# EasyEDA Pro project ESD2 .eprj

# Schematic Schematic1
Board Name: Board1; Create Date: 2026-05-03; Page Name: P1; Project Name: New Project_2026-05-03_08-26-41; Schematic Name: Schematic1; Update Date: 2026-05-03; Company: EasyEDA.com; Page Size: A4; Version: V1.0
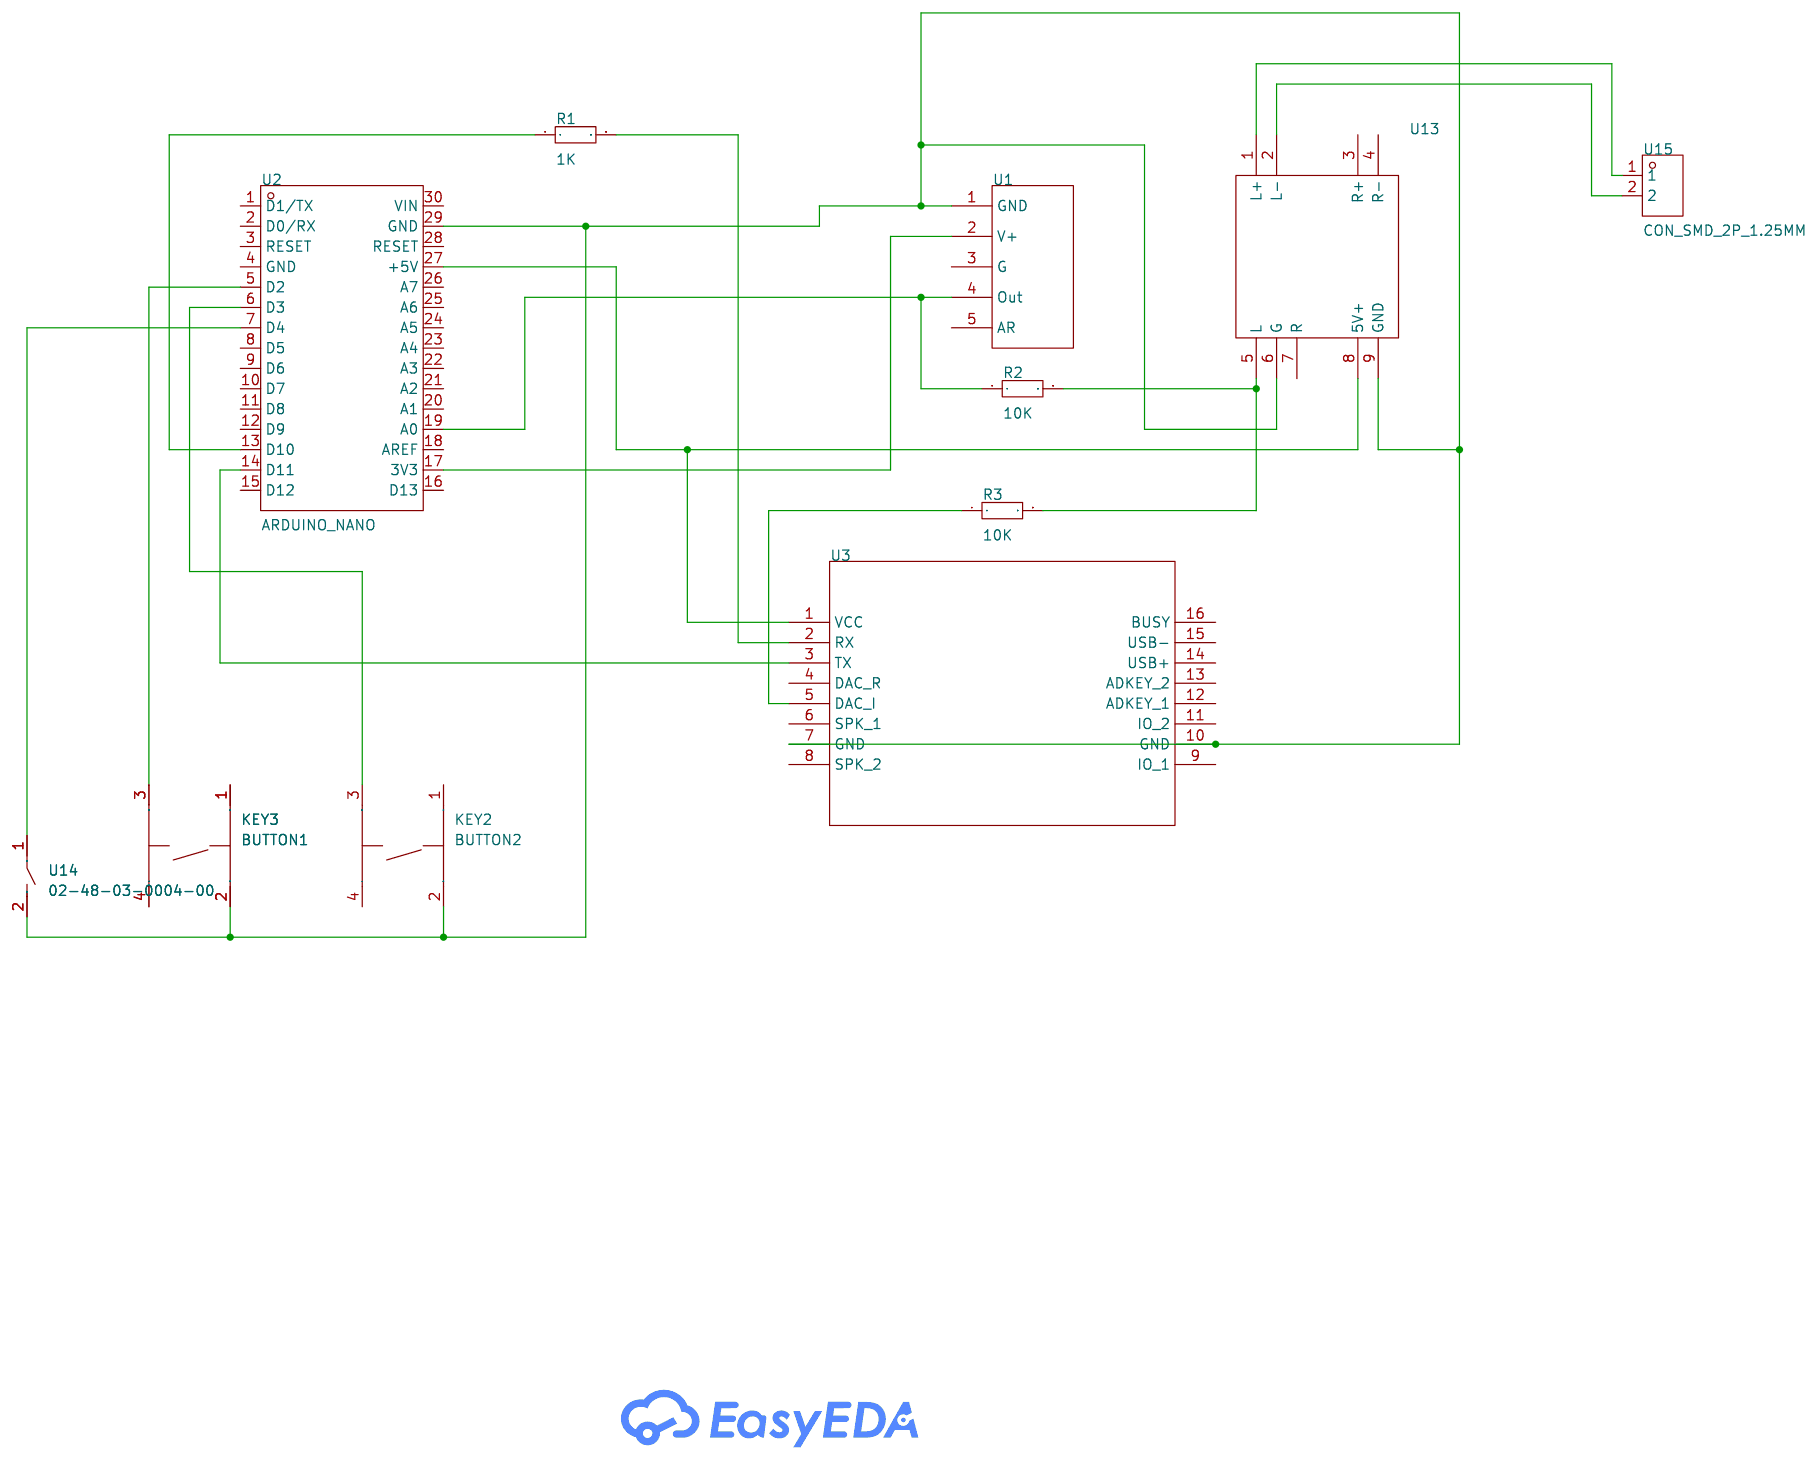
[diagram p0: schematic sheet]

## Parts
KEY2  BUTTON2  [KEY-TH_4P-L6.0-W6.0-P4.50-LS6.5_TC-1102-C-K-B]
KEY3  BUTTON1  [KEY-TH_4P-L6.0-W6.0-P4.50-LS6.5_TC-1102-C-K-B]
R1  1K  [RES-TH_BD2.3-W6.1-P10.10-D0.7]
R2  10K  [RES-TH_BD2.3-W6.1-P10.10-D0.7]
R3  10K  [RES-TH_BD2.3-W6.1-P10.10-D0.7]
U1  -  [Max9814]
U2  ARDUINO_NANO  [COMM-TH_ARDUINO_NANO]
U3  -  [DFPlayer Mini]
U13  -  [Pam8403]
U14  02-48-03-0004-00  [KEY-TH_2P-L6.1-W3.5-P6.50]
U15  CON_SMD_2P_1.25MM  [CONN-TH_C9900006819]

## Library data of the parts
KEY2 KEY3 = BUTTON1: Supplier Part: C9900018962; Supplier Footprint: SMD-4P; JLCPCB Part Class: Extended Part; Supplier: LCSC
R1-R3 = Res_0603: Supplier Footprint: 0603
U1 = Max9814
U2 = ARDUINO_NANO: Supplier Part: C9900017879; Supplier Footprint: 插件; JLCPCB Part Class: Extended Part; Supplier: LCSC
U3 = DFPlayer Mini
U13 = PamFinal
U14 = 02-48-03-0004-00: Supplier Part: C9900014407; Supplier Footprint: SWITCH2-01; JLCPCB Part Class: Extended Part; Supplier: LCSC
U15 = CON_SMD_2P_1.25MM: Supplier Part: C9900006819; Supplier Footprint: SPEAKER; JLCPCB Part Class: Extended Part; Supplier: LCSC

## Nets
Net-(KEY2-2): KEY2.2 KEY3.2 U1.1(GND) U2.29(GND) U3.7(GND) U3.10(GND) U13.6(G) U13.9(GND) U14.2
Net-(KEY2-3): KEY2.3 U2.6(D3)
Net-(KEY3-3): KEY3.3 U2.5(D2)
Net-(R1-1): R1.1 U2.13(D10)
Net-(R1-2): R1.2 U3.2(RX)
Net-(R2-1): R2.1 U1.4(Out) U2.19(A0)
Net-(R2-2): R2.2 R3.2 U13.5(L)
Net-(R3-1): R3.1 U3.5(DAC_I)
Net-(U1-2): U1.2(V+) U2.17(3V3)
Net-(U2-7): U2.7(D4) U14.1
Net-(U2-14): U2.14(D11) U3.3(TX)
Net-(U2-27): U2.27(+5V) U3.1(VCC) U13.8(5V+)
Net-(U13-1): U13.1(L+) U15.1
Net-(U13-2): U13.2(L-) U15.2

Not connected (* = marked no-connect by the designer): KEY2 1 4; KEY3 1 4; U1 3(G) 5(AR); U2 1(D1/TX) 2(D0/RX) 3(RESET) 4(GND) 8(D5) 9(D6) 10(D7) 11(D8) 12(D9) 15(D12) 16(D13) 18(AREF) 20(A1) 21(A2) 22(A3) 23(A4) 24(A5) 25(A6) 26(A7) 28(RESET) 30(VIN); U3 4(DAC_R) 6(SPK_1) 8(SPK_2) 9(IO_1) 11(IO_2) 12(ADKEY_1) 13(ADKEY_2) 14(USB+) 15(USB-) 16(BUSY); U13 3(R+) 4(R-) 7(R)

# Schematic Schematic2
Board Name: PCB2; Create Date: 2026-05-03; Page Name: P1; Project Name: New Project_2026-05-03_08-26-41; Schematic Name: Schematic2; Update Date: 2026-05-03; Company: EasyEDA.com; Page Size: A4; Version: V1.0
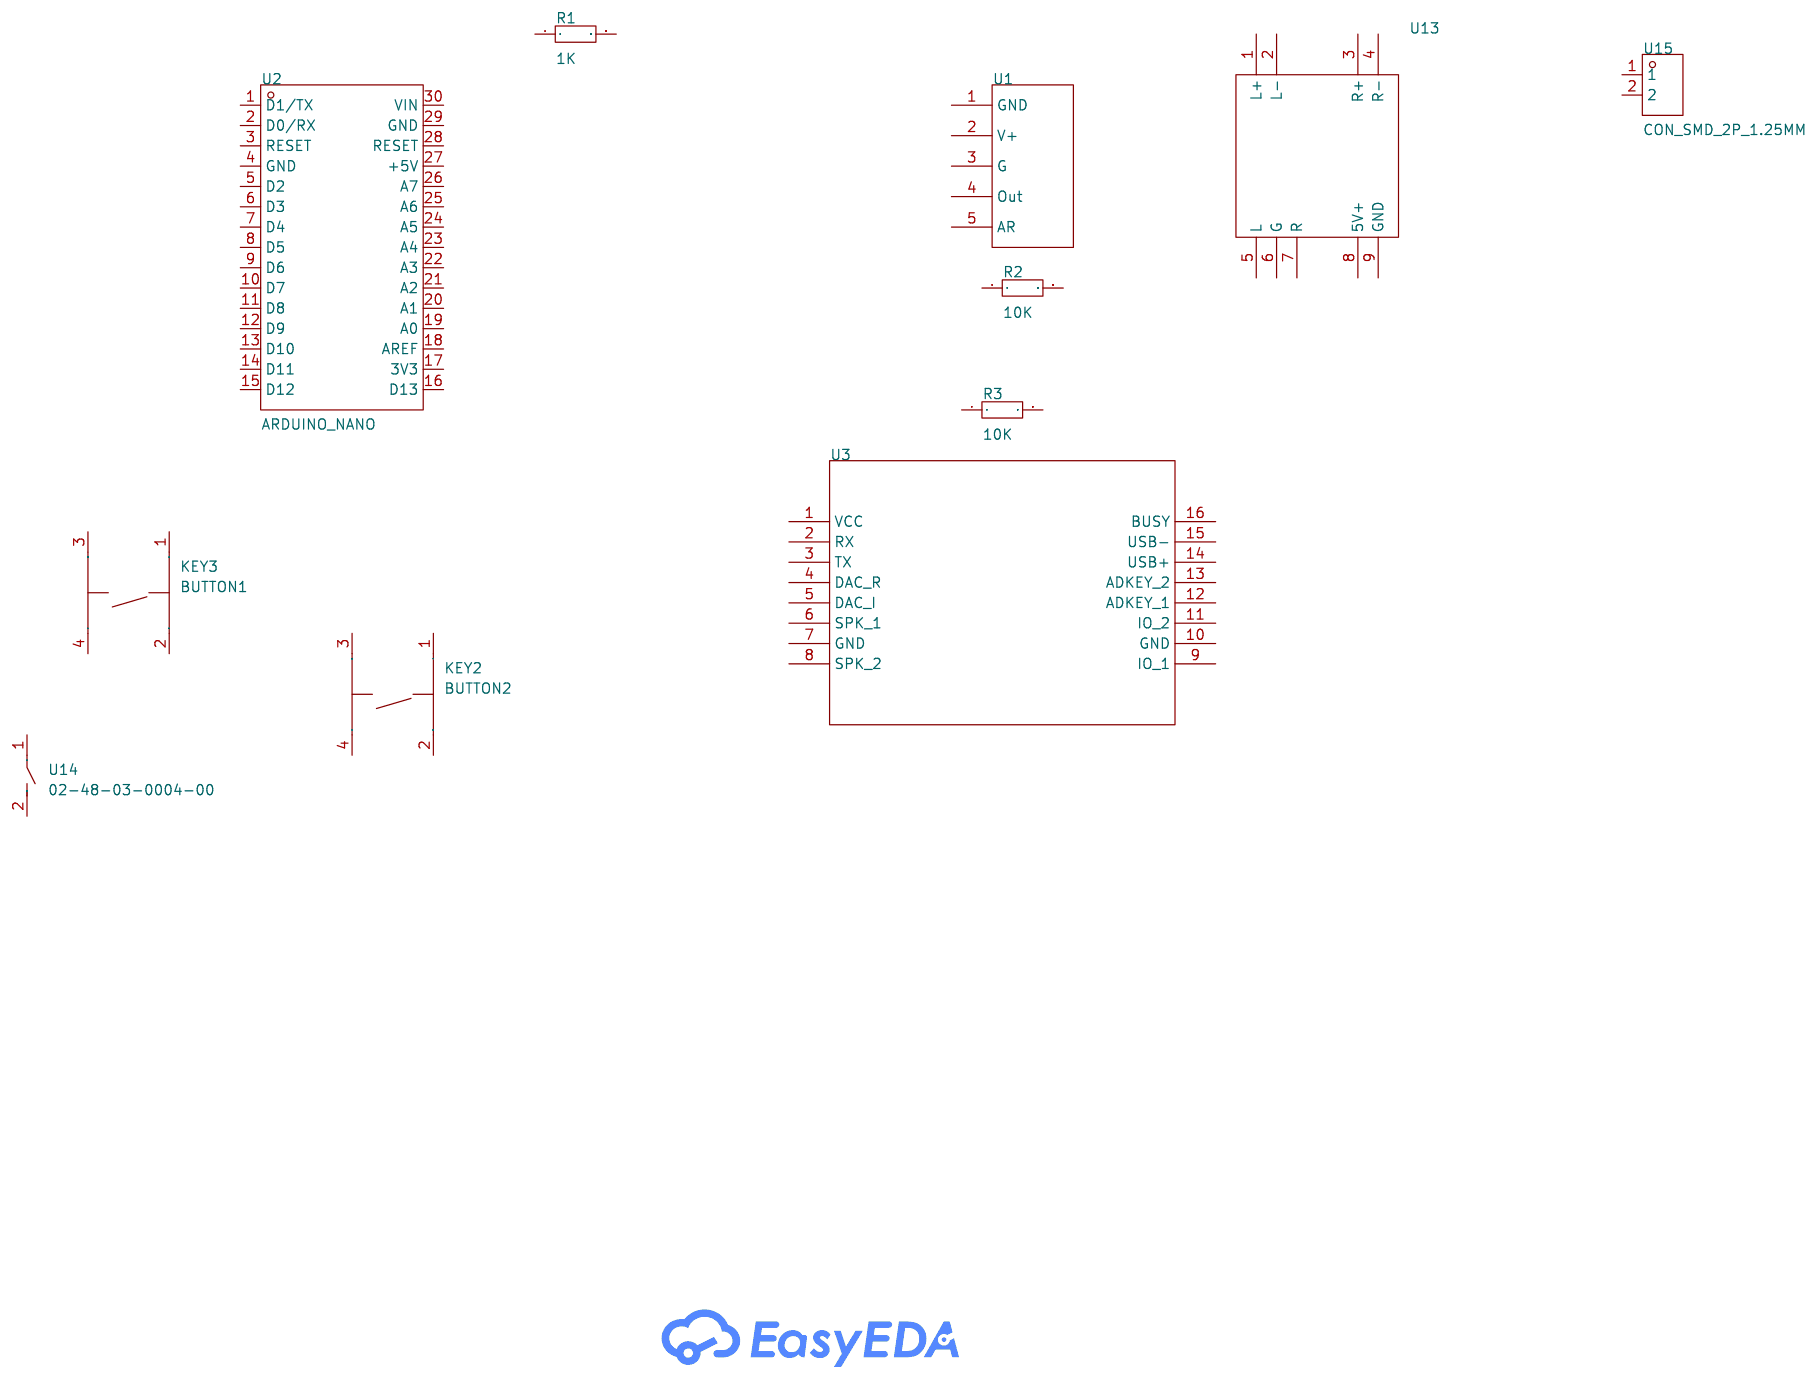
[diagram p1: schematic sheet]

## Parts
KEY2  BUTTON2  [KEY-TH_4P-L6.0-W6.0-P4.50-LS6.5_TC-1102-C-K-B]
KEY3  BUTTON1  [KEY-TH_4P-L6.0-W6.0-P4.50-LS6.5_TC-1102-C-K-B]
R1  1K  [RES-TH_BD2.3-W6.1-P10.10-D0.7]
R2  10K  [RES-TH_BD2.3-W6.1-P10.10-D0.7]
R3  10K  [RES-TH_BD2.3-W6.1-P10.10-D0.7]
U1  -  [Max9814]
U2  ARDUINO_NANO  [COMM-TH_ARDUINO_NANO]
U3  -  [DFPlayer Mini]
U13  -  [Pam8403]
U14  02-48-03-0004-00  [KEY-TH_2P-L6.1-W3.5-P6.50]
U15  CON_SMD_2P_1.25MM  [CONN-TH_C9900006819]

## Library data of the parts
KEY2 KEY3 = BUTTON1: Supplier Part: C9900018962; Supplier Footprint: SMD-4P; JLCPCB Part Class: Extended Part; Supplier: LCSC
R1-R3 = Res_0603: Supplier Footprint: 0603
U1 = Max9814
U2 = ARDUINO_NANO: Supplier Part: C9900017879; Supplier Footprint: 插件; JLCPCB Part Class: Extended Part; Supplier: LCSC
U3 = DFPlayer Mini
U13 = PamFinal
U14 = 02-48-03-0004-00: Supplier Part: C9900014407; Supplier Footprint: SWITCH2-01; JLCPCB Part Class: Extended Part; Supplier: LCSC
U15 = CON_SMD_2P_1.25MM: Supplier Part: C9900006819; Supplier Footprint: SPEAKER; JLCPCB Part Class: Extended Part; Supplier: LCSC

## Nets

Not connected (* = marked no-connect by the designer): KEY2 1 2 3 4; KEY3 1 2 3 4; R1 1 2; R2 1 2; R3 1 2; U1 1(GND) 2(V+) 3(G) 4(Out) 5(AR); U2 1(D1/TX) 2(D0/RX) 3(RESET) 4(GND) 5(D2) 6(D3) 7(D4) 8(D5) 9(D6) 10(D7) 11(D8) 12(D9) 13(D10) 14(D11) 15(D12) 16(D13) 17(3V3) 18(AREF) 19(A0) 20(A1) 21(A2) 22(A3) 23(A4) 24(A5) 25(A6) 26(A7) 27(+5V) 28(RESET) 29(GND) 30(VIN); U3 1(VCC) 2(RX) 3(TX) 4(DAC_R) 5(DAC_I) 6(SPK_1) 7(GND) 8(SPK_2) 9(IO_1) 10(GND) 11(IO_2) 12(ADKEY_1) 13(ADKEY_2) 14(USB+) 15(USB-) 16(BUSY); U13 1(L+) 2(L-) 3(R+) 4(R-) 5(L) 6(G) 7(R) 8(5V+) 9(GND); U14 1 2; U15 1 2

# Board PCB2
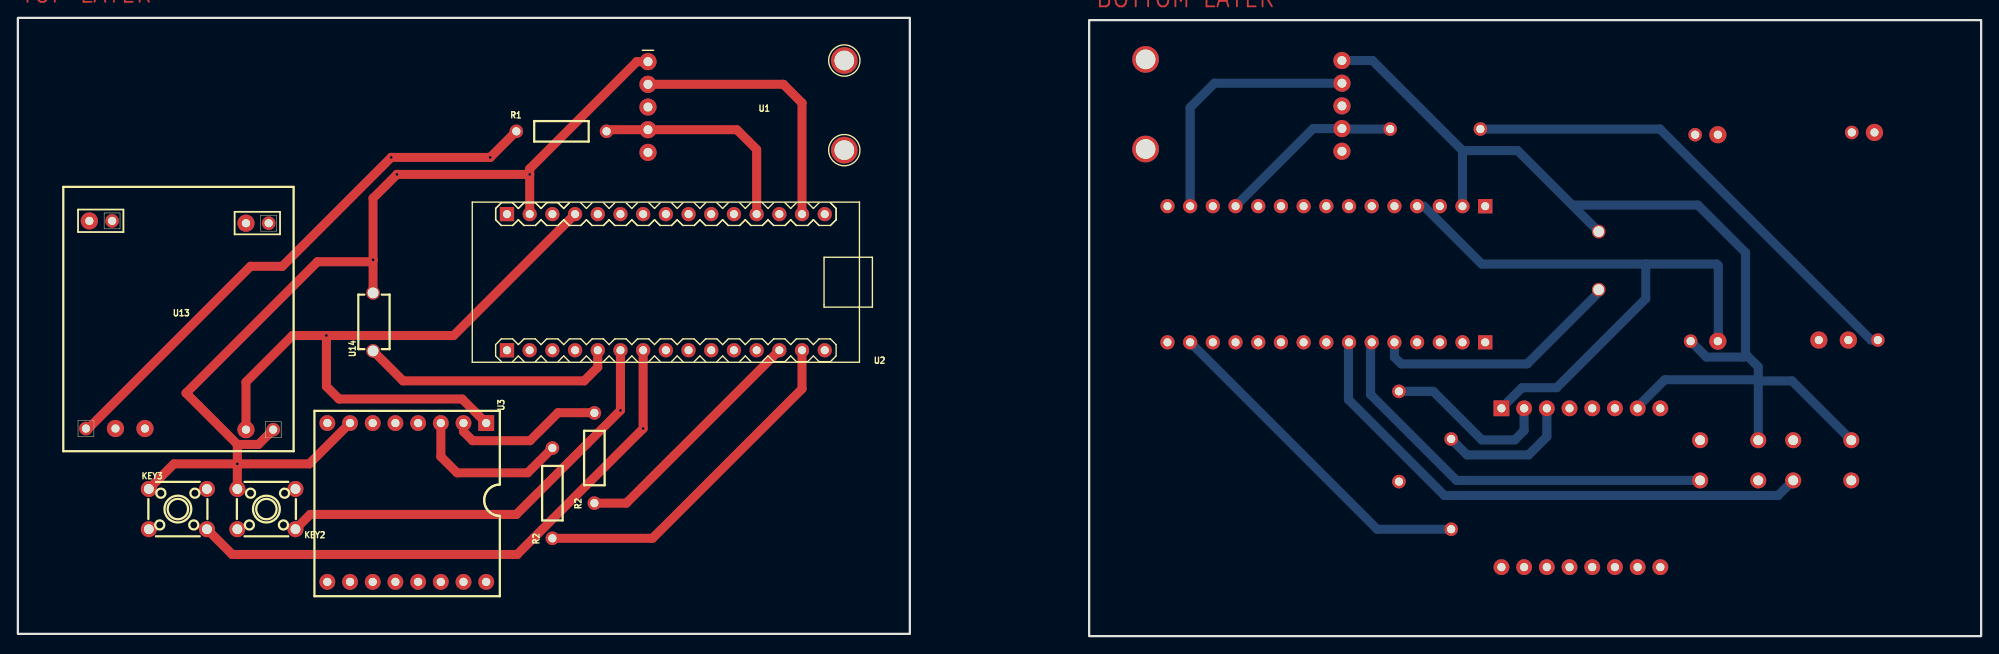
[diagram p2: board, top side]
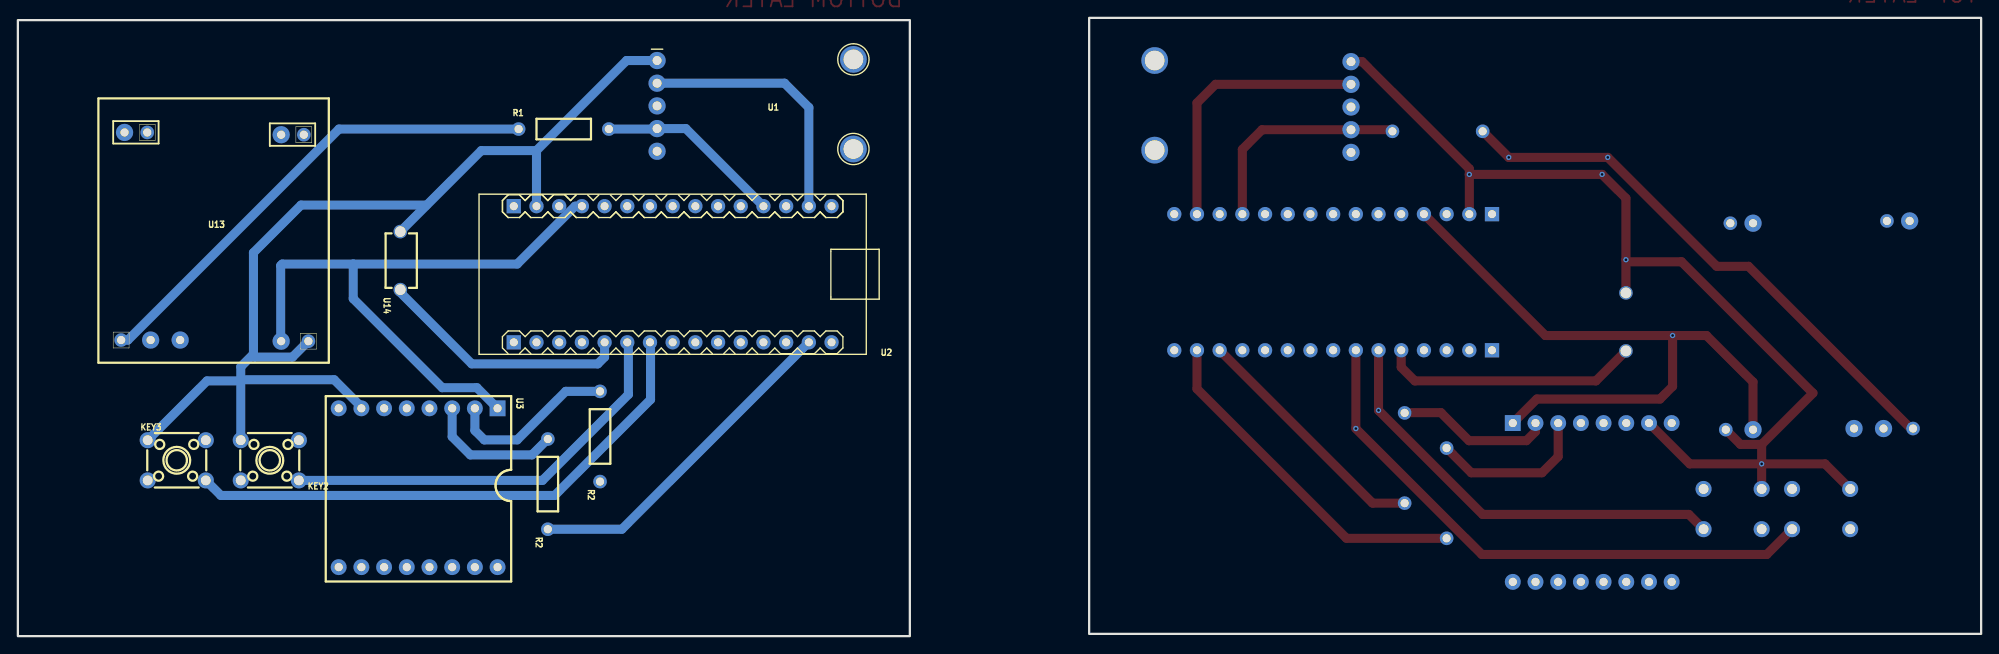
[diagram p3: board, bottom side, seen from below]

Outline 219.71 x 69.21 mm; copper layers: Top Layer, Bottom Layer. Coordinates in mm from the lower left corner of the outline.
Outline path: rectangle 0,69.21 99.82,0.25 ; rectangle 119.89,68.96 219.71,0
Stack: Top Layer 0.035mm / Dielectric1 1.51mm FR4 er 4.5 / Bottom Layer 0.035mm

## Design rules (mm)
template: JLCPCB Capability(Two Layers Board)
spacing copperThickness1oz (default): track to track 0.102, other pairs 0.152 to 0.3
spacing copperThickness2oz: track to track 0.203, other pairs 0.152 to 0.3
track width copperThickness1oz (default): min 0.127, default 0.254, max 2.54
track width copperThickness2oz: min 0.203, default 0.254, max 2.54
differential pair differentialPair (default): width min 0.127, default 0.254, max 2.54; gap min 0.152, default 0.152
via viaSize (default): diameter min 0.5, default 0.61, max 10; hole min 0.3, default 0.305, max 6.3

## Placement (name value [footprint] x y rotation side)
KEY2  BUTTON2  [KEY-TH_4P-L6.0-W6.0-P4.50-LS6.5_TC-1102-C-K-B]  27.81 14.22 180 top
KEY2#2  -  [KEY-TH_4P-L6.0-W6.0-P4.50-LS6.5_TC-1102-C-K-B]  191.52 19.68 0 bottom
KEY3  BUTTON1  [KEY-TH_4P-L6.0-W6.0-P4.50-LS6.5_TC-1102-C-K-B]  17.91 14.22 0 top
KEY3#2  -  [KEY-TH_4P-L6.0-W6.0-P4.50-LS6.5_TC-1102-C-K-B]  201.93 19.68 180 bottom
R1  1K  [RES-TH_BD2.3-W6.1-P10.10-D0.7]  60.83 56.51 0 top
R1#2  -  [RES-TH_BD2.3-W6.1-P10.10-D0.7]  158.62 56.77 180 bottom
R2  10K  [RES-TH_BD2.3-W6.1-P10.10-D0.7]  59.82 16 90 top
R2#2  -  [RES-TH_BD2.3-W6.1-P10.10-D0.7]  64.52 19.94 90 top
R2#3  -  [RES-TH_BD2.3-W6.1-P10.10-D0.7]  160.4 17.02 90 bottom
R2#4  -  [RES-TH_BD2.3-W6.1-P10.10-D0.7]  154.56 22.35 90 bottom
U1  -  [Max9814]  68.33 51.94 0 top
U1#2  -  [Max9814]  150.37 52.07 180 bottom
U2  ARDUINO_NANO  [COMM-TH_ARDUINO_NANO]  72.52 39.62 180 top
U2#2  -  [COMM-TH_ARDUINO_NANO]  146.43 40.51 0 bottom
U3  -  [DFPlayer Mini]  33.02 25.4 270 top
U3#2  -  [DFPlayer Mini]  185.42 27.05 270 bottom
U13  -  [Pam8403]  4.83 20.57 0 top
U13#2  -  [Pam8403]  210.95 30.48 180 bottom
U14  02-48-03-0004-00  [KEY-TH_2P-L6.1-W3.5-P6.50]  39.75 35.18 90 top
U14#2  -  [KEY-TH_2P-L6.1-W3.5-P6.50]  176.91 42.04 90 bottom

## Footprints (pads in the part's own frame, mm; a bottom-side part is the same pattern mirrored in y, then rotated)
COMM-TH_ARDUINO_NANO
  rect 1.6x1.6 hole 0.9: 1(17.78,7.62) 30(17.78,-7.62)
  round 1.6 hole 0.9: 2(15.24,7.62) 3(12.7,7.62) 4(10.16,7.62) 5(7.62,7.62) 6(5.08,7.62) 7(2.54,7.62) 8(0,7.62) 9(-2.54,7.62) 10(-5.08,7.62) 11(-7.62,7.62) 12(-10.16,7.62) 13(-12.7,7.62) 14(-15.24,7.62) 15(-17.78,7.62) 16(-17.78,-7.62) 17(-15.24,-7.62) 18(-12.7,-7.62) 19(-10.16,-7.62) 20(-7.62,-7.62) 21(-5.08,-7.62) 22(-2.54,-7.62) 23(0,-7.62) 24(2.54,-7.62) 25(5.08,-7.62) 26(7.62,-7.62) 27(10.16,-7.62) 28(12.7,-7.62) 29(15.24,-7.62)
DFPlayer Mini
  rect 1.778x1.778 hole 0.914: 1(1.546,19.392)
  round 1.778 hole 0.914: 2(1.546,16.852) 3(1.546,14.312) 4(1.546,11.772) 5(1.546,9.232) 6(1.546,6.692) 7(1.546,4.152) 8(1.546,1.612) 9(19.326,1.612) 10(19.326,4.152) 11(19.326,6.692) 12(19.326,9.232) 13(19.326,11.772) 14(19.326,14.312) 15(19.326,16.852) 16(19.326,19.392)
KEY-TH_2P-L6.1-W3.5-P6.50
  round 1.524 hole 1.2: 1(-3.25,0) 2(3.25,0)
KEY-TH_4P-L6.0-W6.0-P4.50-LS6.5_TC-1102-C-K-B
  round 1.8 hole 1.1: 1(-3.251,-2.251) 2(3.251,-2.251) 3(3.251,2.251) 4(-3.251,2.251)
Max9814
  round 1.931 hole 1: 1(2.191,12.37) 2(2.191,9.83) 3(2.191,7.29) 4(2.191,4.75) 5(2.191,2.21)
  round 3 hole 2.2: 6(24.162,12.497) 7(24.162,2.464)
Pam8403
  round 1.931 hole 0.914: 1(3.175,25.908)
  round 1.524 hole 0.914: 2(5.715,25.908) 4(23.241,25.654) 5(2.794,2.667) 9(23.749,2.54)
  round 1.93 hole 0.914: 3(20.701,25.654) 6(6.096,2.667) 7(9.398,2.667) 8(20.701,2.54)
RES-TH_BD2.3-W6.1-P10.10-D0.7
  round 1.524 hole 0.914: 1(-5.05,0) 2(5.05,0)

## Nets
As in the schematic.

Pads without a net: KEY2 1 2 3 4; KEY2#2 1 2 3 4; KEY3 1 2 3 4; KEY3#2 1 2 3 4; R1 1 2; R1#2 1 2; R2 1 2; R2#2 1 2; R2#3 1 2; R2#4 1 2; U1 1 2 3 4 5 6 7; U1#2 1 2 3 4 5 6 7; U2 1 2 3 4 5 6 7 8 9 10 11 12 13 14 15 16 17 18 19 20 21 22 23 24 25 26 27 28 29 30; U2#2 1 2 3 4 5 6 7 8 9 10 11 12 13 14 15 16 17 18 19 20 21 22 23 24 25 26 27 28 29 30; U3 1 2 3 4 5 6 7 8 9 10 11 12 13 14 15 16; U3#2 1 2 3 4 5 6 7 8 9 10 11 12 13 14 15 16; U13 1 2 3 4 5 6 7 8 9; U13#2 1 2 3 4 5 6 7 8 9; U14 1 2; U14#2 1 2

## Via types
v1: diameter 0.61, hole 0.305, Top Layer to Bottom Layer, 9 vias

## Routing (per net, layer and track width the routed paths; a pad name or vN(x,y) marks a point on that pad's centre or on a via; arc(x,y) is an arc through that point)
(no net): length 1064.7
  Top Layer w1.016: KEY3.4 17.47,19.28 v1(24.56,19.28) ; 24.56,21.46 18.82,27.2 33.53,41.91 39.52,41.91 v1(39.75,42.14) ; 24.56,21.46 v1(24.56,19.28) ; 24.56,21.46 26.92,21.46 U13.9 ; U13.8 25.53,28.45 30.73,33.65 v1(34.53,33.65) ; U3.7 32.6,19.28 v1(24.56,19.28) ; v1(39.75,42.14) 39.75,49.02 v1(42.42,51.69) v1(57.28,51.69) ; v1(39.75,42.14) U14.2 ; U3.1 49.72,26.54 35.94,26.54 34.53,27.95 v1(34.53,33.65) ; U2.19 82.68,54.48 80.47,56.69 U1.4 66.06,56.69 R1.2 ; U2.7 v1(69.98,23.24) 55.88,9.14 23.99,9.14 KEY3.2 ; R2.1 71.02,10.95 87.76,27.69 U2.14 ; v1(34.53,33.65) 48.77,33.65 U2.27 ; R2#2.2 64.49,25.02 60.45,25.02 57.32,21.88 50.89,21.88 49.87,22.9 U3.2 ; R2.2 57.05,18.29 49.15,18.29 47.33,20.1 U3.3 ; U2.17 87.76,59.69 85.67,61.77 U1.2 ; v1(24.56,19.28) KEY2.2 ; v1(57.28,51.69) U2.29 ; v1(57.28,51.69) 57.28,52.32 69.27,64.31 U1.1 ; R1.1 v1(52.86,53.59) v1(41.78,53.59) 29.59,41.4 26.04,41.4 7.87,23.24 U13.5 ; U2.6 v1(67.44,25.27) 55.79,13.62 32.71,13.62 KEY2.4 ; U14.1 43.1,28.57 63.37,28.57 64.9,30.1 U2.5 ; R2#2.1 68.1,14.89 U2.13
  Bottom Layer w1.016: 194.56,28.7 184.31,28.7 181.27,25.66 181.27,25.5 ; U14#2.2 167.84,54.36 161.67,54.36 ; 193.42,31.5 194.77,30.15 KEY2#2.2 ; R2#4.2 158.4,27.4 163.83,21.97 167.51,21.97 168.57,23.03 168.57,25.5 ; 166.03,25.5 168.34,27.81 172.21,27.81 182.18,37.78 182.18,41.66 ; U2#2.7 148.91,32.83 148.91,26.48 159.64,15.75 196.99,15.75 KEY3#2.2 ; 182.18,41.66 163.83,41.66 157.35,48.13 U2#2.27 ; 182.18,41.66 190.12,41.66 190.3,41.48 190.3,33.07 U13#2.8 ; R2#3.1 152.12,11.97 U2#2.14 ; R1#2.2 148.23,56.77 U1#2.4 144.96,56.82 U2#2.19 ; R2#3.2 162.18,20.29 169.07,20.29 171.11,22.33 171.11,25.5 ; 161.67,54.36 151.59,64.44 U1#2.1 ; 161.67,54.36 U2#2.29 ; U14#2.1 176.91,38.48 168.91,30.48 154.81,30.48 154.05,31.24 U2#2.5 ; U13#2.9 188.98,31.24 193.17,31.24 193.35,31.42 193.35,42.93 188.01,48.26 173.99,48.26 ; U1#2.2 133.91,61.9 131.19,59.18 U2#2.17 ; 194.94,28.57 198.54,28.57 KEY3#2.4 ; U13#2.5 207.39,33.15 183.77,56.77 R1#2.1 ; U2#2.6 151.38,32.77 151.38,27.05 161,17.43 KEY2#2.4

## Text on the board
Top Layer: TOP LAYER | BOTTOM LAYER
